# Altium schematic sheet 2-Amplifier.SchDoc
size A4; Author: Fabian Castaño; CompanyName: GIBIC Tech-Hub; Engineer: Fabian Castaño; Organization: Universidad de Antioquia; Address1: UdeA; Address2: Medellín; Address3: Antioquia; Address4: Colombia 050010; DocumentNumber: 3; SheetNumber: 3; SheetTotal: 4
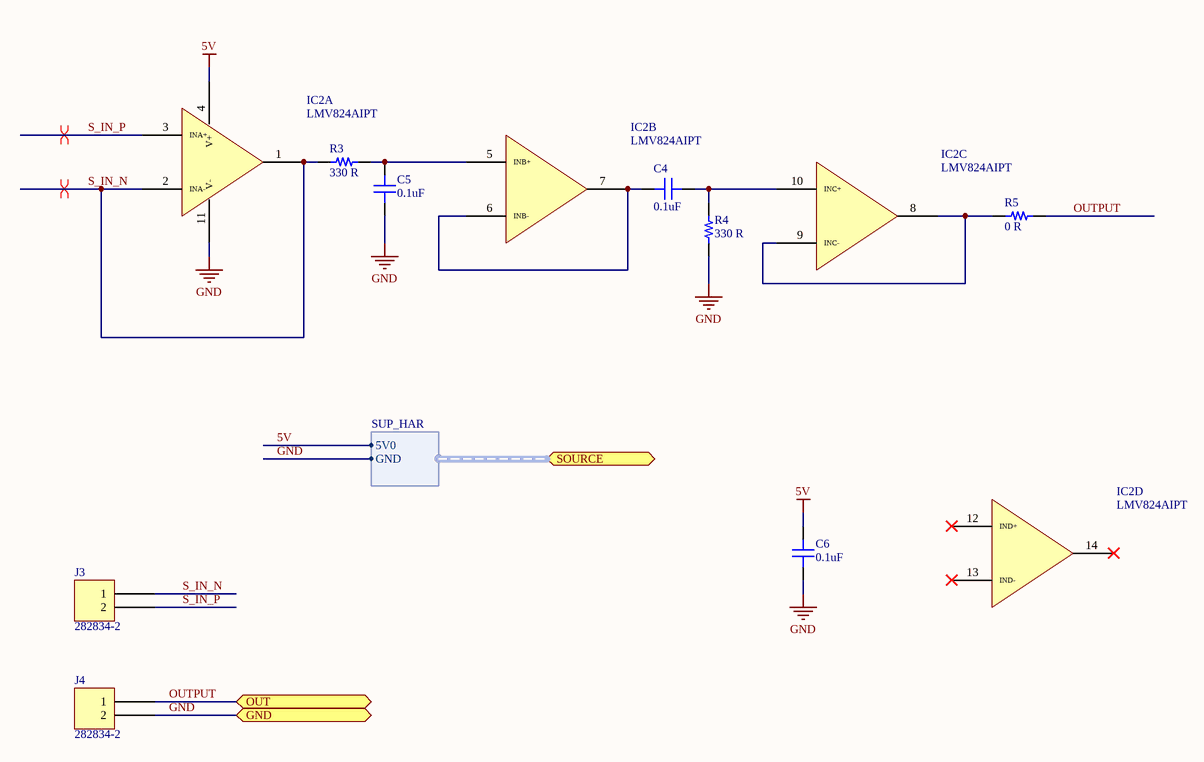
[diagram p0: 2-Amplifier.SchDoc]

## Parts
C4  0.1uF  [CAP 0805_2012]
C5  0.1uF  [CAP 0805_2012]
C6  0.1uF  [CAP 0805_2012]
IC2  LMV824AIPT  [TI TSSOP-14 PW]  (parts A,B,C,D of 4)
J3  282834-2  [TE 282834-2]
J4  282834-2  [TE 282834-2]
R3  330 R  [RES 0805_2012]
R4  330 R  [RES 0805_2012]
R5  0 R  [RES 0805_2012]

## Ports
GND, OUT, SOURCE (harness SUP_HAR)

## Harnesses
SUP_HAR: 5V0, GND

## Nets
5V: C6.2 IC2.4(V+) ; port SOURCE.5V0
GND: C5.1 C6.1 IC2.11(V-) J4.2 R4.1 ; port GND, port SOURCE.GND
OUTPUT: J4.1 R5.1 ; port OUT
S_IN_N: IC2.1(OUT) IC2.2(INA-) J3.1 R3.1
S_IN_P: IC2.3(INA+) J3.2
NetC4_1: C4.1 IC2.10(INC+) R4.2
NetC4_2: C4.2 IC2.6(INB-) IC2.7(OUTB)
NetC5_2: C5.2 IC2.5(INB+) R3.2
NetIC2_8: IC2.8(OUTC) IC2.9(INC-) R5.2

Not connected (* = marked no-connect by the designer): IC2 12(IND+)* 13(IND-)* 14(OUTD)*

## Layout directives
differential pair: S_IN_N, S_IN_P

## Notes on the sheet
- Notes
- Title
- Size:
- Date:
- A4
- Number:
- Time:
- Revision:
- Sheet
- of
- File:

## Library data of the parts
C4-C6 = CBR08C569BCGAC: CAP CER 5.6PF 500V C0G/NP0 0805; Manufacturer: KEMET; Temperature Coefficient: C0G, NP0; Tolerance: ±0.1pF; Part Number: CBR08C569BCGAC; Value: 0.1uF; Applications: RF, Microwave, High Frequency; Capacitance: 5.6pF; ComponentLink1Description: Datasheet; ComponentLink1URL: https://api.kemet.com/component-edge/download/datasheet/CBR08C569BCGAC.pdf; ComponentLink2Description: DigiKey Link; ComponentLink2URL: http://digikey.com/product-detail/en/kemet/CBR08C569BCGAC/399-11260-1-ND/4376887; Device Package: 0805 (2012 Metric); Features: High Q, Low Loss, Ultra Low ESR; LastUpdated: 2/09/2020 01:04:42; Lifecycle Status: Active; Minimum Order: 1; Mounting Type: Surface Mount, MLCC; Operating Temperature: -55°C ~ 125°C; Package / Case: 0805 (2012 Metric); Packaging: TapeAndReel; PartId: 2427; Part Status: Active; Price: 0.48; Series: CBR-SMD RF C0G; Size / Dimension: 0.079" L x 0.049" W (2.00mm x 1.25mm); Supplier 1: DigiKey; Supplier Part Number 1: 399-11260-1-ND; Thickness (Max): 0.037" (0.95mm); Voltage - Rated: 500V
IC2 = LMV824AIPT: IC OPAMP GP 4 CIRCUIT 14TSSOP; Manufacturer: STMicroelectronics; Amplifier Type: General Purpose; Current - Input Bias: 60nA; Current - Output / Channel: 70mA; Current - Supply: 300µA; Gain Bandwidth Product: 5.5MHz; Number of Circuits: 4; Output Type: Rail-to-Rail; Slew Rate: 1.9V/µs; Voltage - Input Offset: 800µV; Voltage - Supply, Single/Dual (±): 2.5V ~ 5.5V; Part Number: LMV824AIPT; ComponentLink1Description: Datasheet; ComponentLink1URL: http://www.st.com/content/ccc/resource/technical/document/datasheet/39/12/97/14/01/a7/4f/de/DM00041851.pdf/files/DM00041851.pdf/jcr:content/translations/en.DM00041851.pdf; ComponentLink2Description: DigiKey Link; ComponentLink2URL: http://digikey.com/product-detail/en/stmicroelectronics/LMV824AIPT/497-12825-1-ND/3028576; Device Package: 14-TSSOP (0.173", 4.40mm Width); LastUpdated: 9/01/2020 02:13:49; Lifecycle Status: Active; Minimum Order: 1; Mounting Type: Surface Mount; Operating Temperature: -40°C ~ 125°C; Package / Case: 14-TSSOP (0.173", 4.40mm Width); Packaging: ReReel; PartId: 21; Part Status: Active; Price: 0.00; Series: -; Supplier 1: DigiKey; Supplier Part Number 1: 497-12825-1-ND; Supplier Device Package: 14-TSSOP
J3 J4 = 282834-2: TERM BLK 2P SIDE ENT 2.54MM PCB; Manufacturer: TE Connectivity AMP Connectors; Current: 10A; Mating Orientation: Horizontal with Board; Number of Levels: 1; Pitch: 0.100" (2.54mm); Positions Per Level: 2; Voltage: 150V; Wire Gauge: 16-30 AWG; Wire Termination: Screw - Rising Cage Clamp; Part Number: 282834-2; Color: Green; ComponentLink1Description: Datasheet; ComponentLink1URL: https://www.te.com/commerce/DocumentDelivery/DDEController?Action=srchrtrv&DocNm=282834&DocType=Customer+Drawing&DocLang=English; ComponentLink2Description: DigiKey Link; ComponentLink2URL: http://digikey.com/product-detail/en/te-connectivity-amp-connectors/282834-2/A98333-ND/1150135; LastUpdated: 15/01/2020 04:15:38; Lifecycle Status: Active; Minimum Order: 1; Mounting Type: Through Hole; Packaging: Bulk; Part Status: Active; Price: 0.88; Series: Buchanan; Supplier 1: DigiKey; Supplier Part Number 1: A98333-ND
R3-R5 = RNCF0805DTE82K0: RES 82K OHM 0.5% 1/8W 0805; Manufacturer: Stackpole Electronics Inc; Power (Watts): 0.125W, 1/8W; Resistance: 82 kOhms; Temperature Coefficient: ±25ppm/°C; Part Number: RNCF0805DTE82K0; ComponentLink1Description: Datasheet; ComponentLink1URL: https://www.seielect.com/catalog/sei-rncf.pdf; ComponentLink2Description: DigiKey Link; ComponentLink2URL: http://digikey.com/product-detail/en/stackpole-electronics-inc/RNCF0805DTE82K0/RNCF0805DTE82K0CT-ND/9915472; Composition: Thin Film; Device Package: 0805 (2012 Metric); Features: Automotive AEC-Q200; Height - Seated (Max): 0.026" (0.65mm); LastUpdated: 2/09/2020 01:15:08; Lifecycle Status: Active; Minimum Order: 1; Number of Terminations: 2; Operating Temperature: -55°C ~ 155°C; Package / Case: 0805 (2012 Metric); Packaging: TapeAndReel; PartId: 35165; Part Status: Active; Price: 0.02; Ratings: AEC-Q200; Series: RNCF; Size / Dimension: 0.079" L x 0.049" W (2.00mm x 1.25mm); Supplier 1: DigiKey; Supplier Part Number 1: RNCF0805DTE82K0CT-ND; Supplier Device Package: 0805; Tolerance: ±0.5%
  R3 R4: Value: 330 R
  R5: Value: 0 R